# Altium schematic sheet tracker_usb_c.SchDoc
size A; SheetNumber: 2; SheetTotal: 2
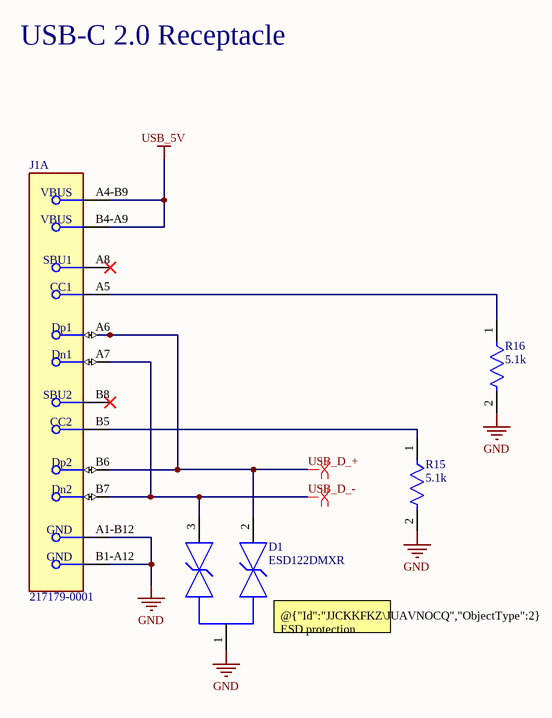
[diagram p0: tracker_usb_c.SchDoc]

## Parts
D1  ESD122DMXR  [FP-DMX0003A-MFG]
J1  217179-0001  [FP-2171790001-MFG]  (part A of 2)
R15  5.1k  [FP-MCT0603-IPC_B]
R16  5.1k  [FP-MCT0603-IPC_B]

## Nets
GND: D1.1(GND) J1.A1-B12(GND) J1.B1-A12(GND) R15.2 R16.2
USB_5V: J1.A4-B9(VBUS) J1.B4-A9(VBUS)
USB_D_+: D1.2(IO1) J1.A6(Dp1) J1.B6(Dp2)
USB_D_-: D1.3(IO2) J1.A7(Dn1) J1.B7(Dn2)
NetJ1_A5: J1.A5(CC1) R16.1
NetJ1_B5: J1.B5(CC2) R15.1

Not connected (* = marked no-connect by the designer): J1 A8(SBU1)* B8(SBU2)*

## Layout directives
differential pair: USB_D_+, USB_D_-

## Notes on the sheet
- USB-C 2.0 Receptacle
- (near D1) @{"Id":"JJCKKFKZ\JUAVNOCQ","ObjectType":2} ESD protection

## Library data of the parts
D1 = CMP-04989-000013-1: TVS DIODE 3.6V 8.4V 3X2SON; Peak Pulse Power: 20W; Min Breakdown Voltage: 5.1V; Average Rectified Current: 10A; Element Configuration: Common Cathode; Number of Channels: 2; Max Reverse Voltage (DC): 100V; Interface: USB; Power Line Protection: No; Peak Pulse Current: 2.5A; Clamping Voltage: 8.4V; Min Operating Temperature: -40°C; Number of Pins: 3; Resistor Type: Zener; Mount: Through Hole; Case/Package: TO-220-3; Reverse Standoff Voltage: 3.6V; RoHS Compliant: Yes; Max Operating Temperature: 125°C; Number of Bidirectional Channels: 2; Packaging: Rail/Tube
J1 = CMP-04767-000028-2: CONN RCP USB2.0 TYP C 24P SMD RA; NexarPartId: 117190526; Gender: Receptacle; Number of Contacts: 16; Current Rating: 1.25A; Voltage Rating: 30V; Min Operating Temperature: -40°C; USB Standard: USB 2.0; Height: 3.36mm; Contact Material: Gold, Nickel; Max Operating Temperature: 85°C
R15 R16 = CMP-02407-010205-1: RES SMD 100 OHM 1% 1/8W 0603; Resistance: 5.1kR; Tolerance: 0.1%; Temperature Coefficient: 25ppm/°C; Max Operating Temperature: 125°C; Radiation Hardening: No; Composition: Thin Film; Height: 450um; Lead Free: Lead Free; Contact Plating: Tin; Length: 1.55mm; Width: 850um; Case/Package: 0603; Min Operating Temperature: -55°C